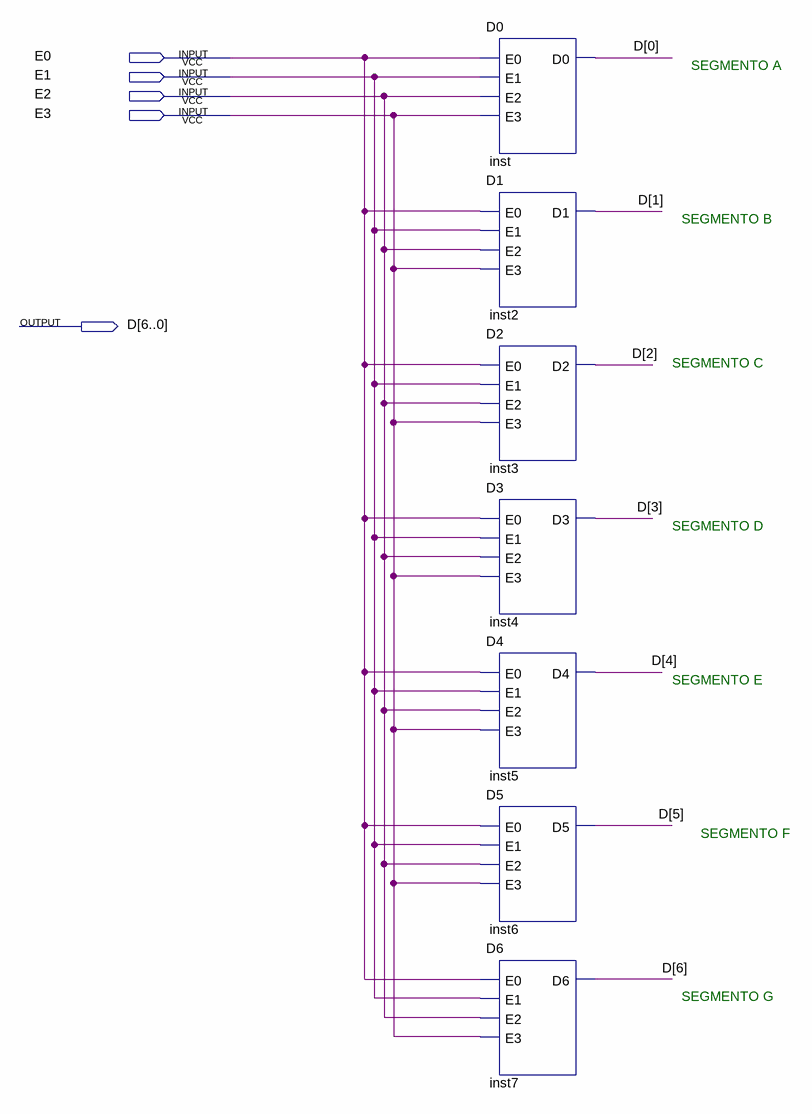
[diagram p0: schematic sheet]
// Quartus schematic DISPLAY_neander.bdf as structural Verilog: 7 symbols, 5 pins
module DISPLAY_neander (
  input  E0,
  input  E1,
  input  E2,
  input  E3,
  output [6:0] D
);

  D0 inst (.E0(E0), .E1(E1), .E2(E2), .E3(E3), .D0(D[0]));
  D1 inst2 (.E0(E0), .E1(E1), .E2(E2), .E3(E3), .D1(D[1]));
  D2 inst3 (.E0(E0), .E1(E1), .E2(E2), .E3(E3), .D2(D[2]));
  D3 inst4 (.E0(E0), .E1(E1), .E2(E2), .E3(E3), .D3(D[3]));
  D4 inst5 (.E0(E0), .E1(E1), .E2(E2), .E3(E3), .D4(D[4]));
  D5 inst6 (.E0(E0), .E1(E1), .E2(E2), .E3(E3), .D5(D[5]));
  D6 inst7 (.E0(E0), .E1(E1), .E2(E2), .E3(E3), .D6(D[6]));

  // Notes on the sheet:
  //   SEGMENTO A
  //   SEGMENTO B
  //   SEGMENTO C
  //   SEGMENTO D
  //   SEGMENTO E
  //   SEGMENTO F
  //   SEGMENTO G
endmodule
